# EAGLE design AlphaProtoRev3 (EAGLE 6.5.0)
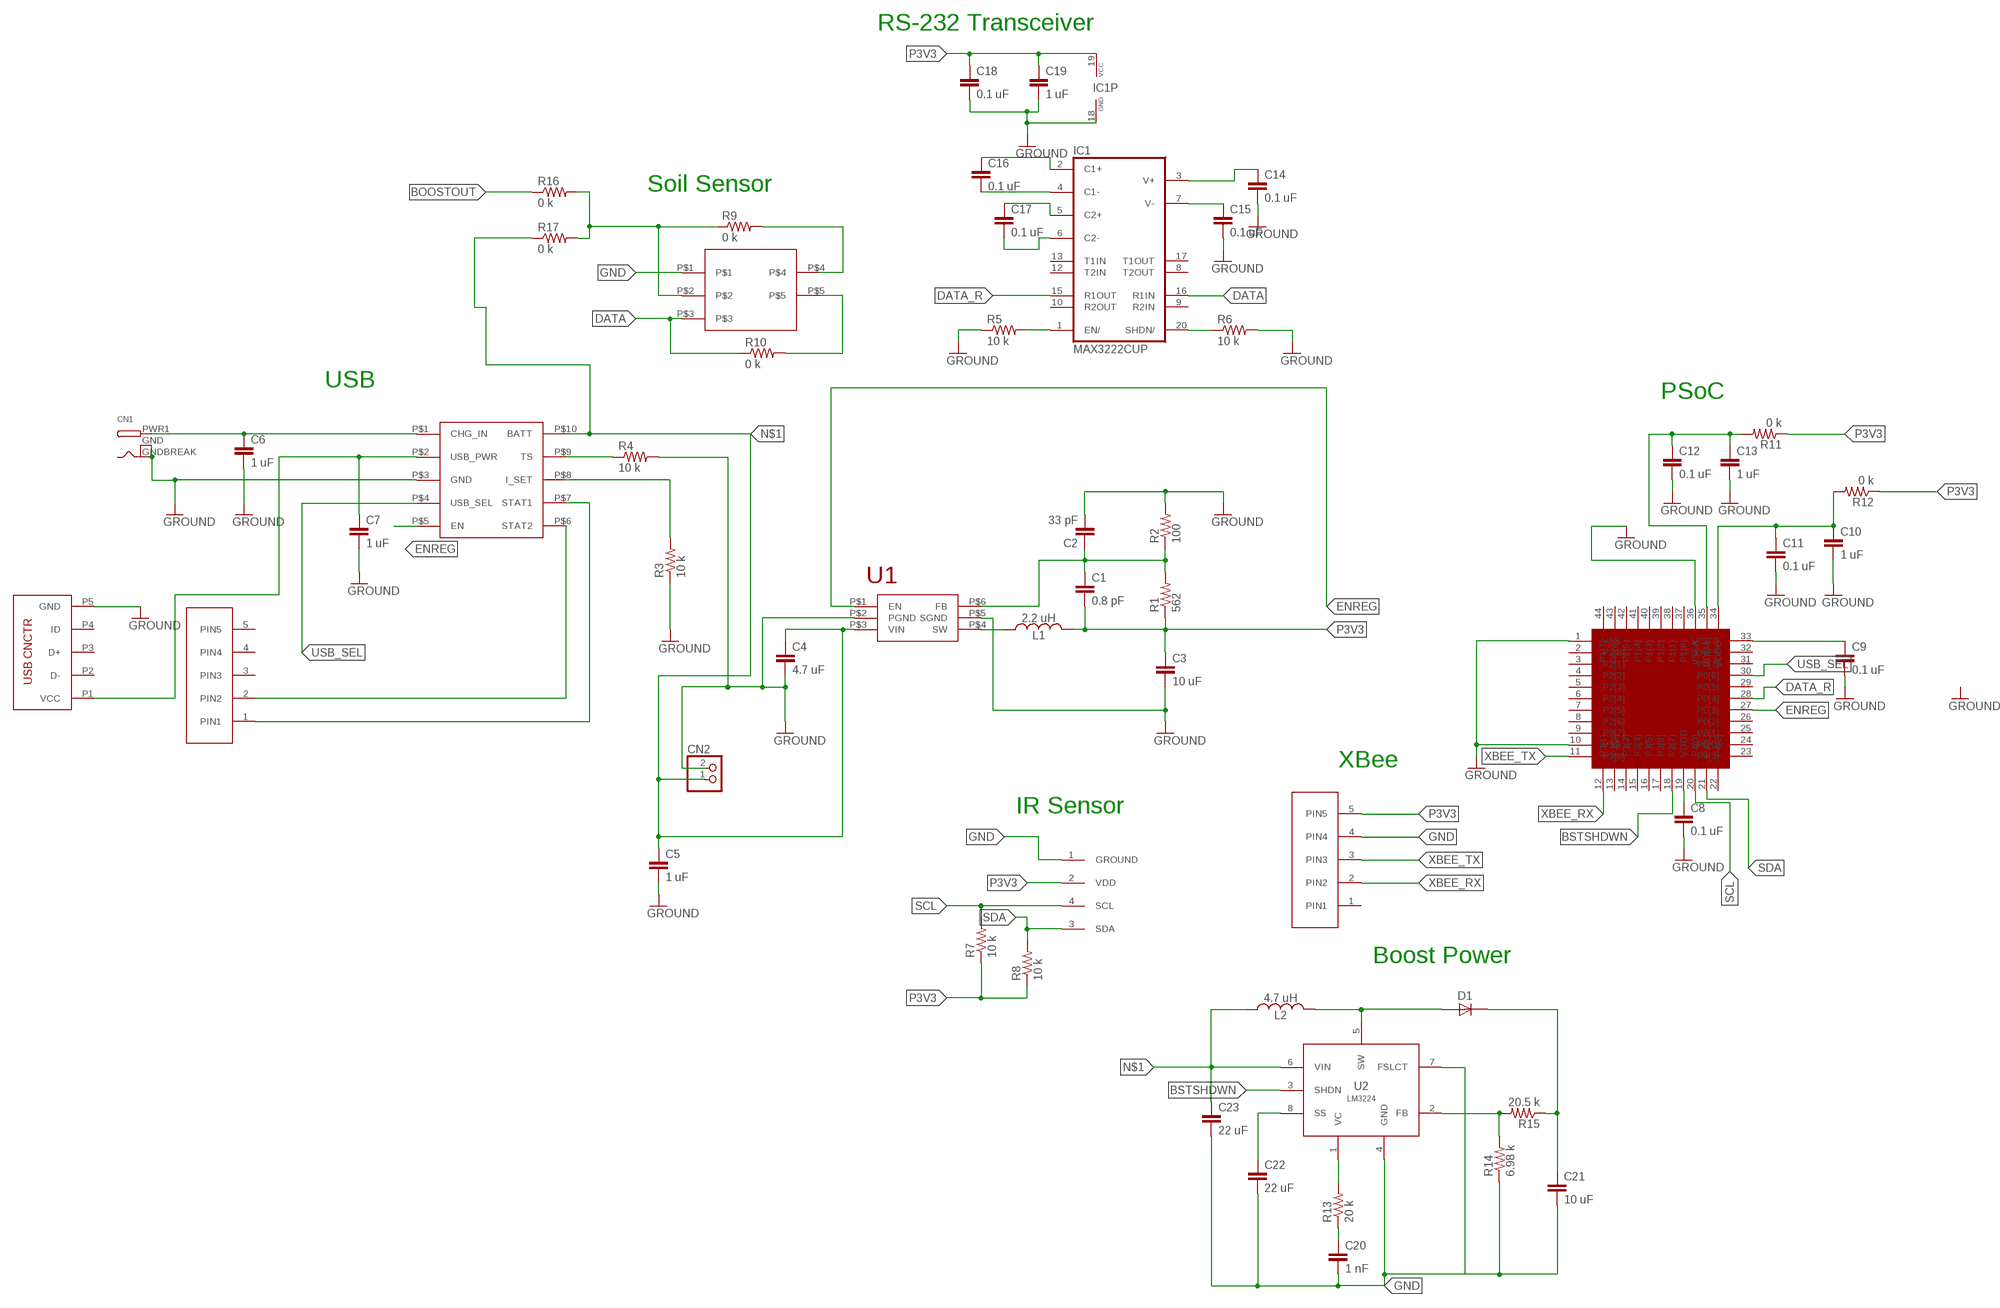
[diagram p0: schematic, sheet 1]

## Parts
C1  0.8 pF  CAPACITOR0603  [0603]
C2  33 pF  CAPACITOR0603  [0603]
C3  10 uF  CAPACITOR0603  [0603]
C4  4.7 uF  CAPACITOR0603  [0603]
C5  1 uF  CAPACITOR0603  [0603]
C6  1 uF  CAPACITOR0603  [0603]
C7  1 uF  CAPACITOR0603  [0603]
C8  0.1 uF  CAPACITOR0603  [0603]
C9  0.1 uF  CAPACITOR0603  [0603]
C10  1 uF  CAPACITOR0603  [0603]
C11  0.1 uF  CAPACITOR0603  [0603]
C12  0.1 uF  CAPACITOR0603  [0603]
C13  1 uF  CAPACITOR0603  [0603]
C14  0.1 uF  CAPACITOR0603  [0603]
C15  0.1 uF  CAPACITOR0603  [0603]
C16  0.1 uF  CAPACITOR0603  [0603]
C17  0.1 uF  CAPACITOR0603  [0603]
C18  0.1 uF  CAPACITOR0603  [0603]
C19  1 uF  CAPACITOR0603  [0603]
C20  1 nF  CAPACITOR0603  [0603]
C21  10 uF  CAPACITOR0603  [0603]
C22  22 uF  CAPACITOR0603  [0603]
C23  22 uF  CAPACITOR0603  [0603]
CN1  DCBARRELSMT  [DCJACK_2MM_SMT]
CN2  JST_2PIN-SMT-RA  [JST-PH-2-SMT-RA]
D1  DIODE  [0603-LED]
IC  PSOC4FP  [TQFP44]
IC1  MAX3222CUP  [TSSOP20]
IRSENSOR  TO39  [TO39]
L1  2.2 uH  INDUCTOR0603  [0603]
L2  4.7 uH  INDUCTOR0603  [0603]
R1  562  RESISTOR0603  [0603]
R2  100  RESISTOR0603  [0603]
R3  10 k  RESISTOR0603  [0603]
R4  10 k  RESISTOR0603  [0603]
R5  10 k  RESISTOR0603  [0603]
R6  10 k  RESISTOR0603  [0603]
R7  10 k  RESISTOR0603  [0603]
R8  10 k  RESISTOR0603  [0603]
R9  0 k  RESISTOR0603  [0603]
R10  0 k  RESISTOR0603  [0603]
R11  0 k  RESISTOR0603  [0603]
R12  0 k  RESISTOR0603  [0603]
R13  20 k  RESISTOR0603  [0603]
R14  6.98 k  RESISTOR0603  [0603]
R15  20.5 k  RESISTOR0603  [0603]
R16  0 k  RESISTOR0603  [0603]
R17  0 k  RESISTOR0603  [0603]
U1  LM3671-407564  [LM3671-407564]
U2  LM3224  [MSOP-8]
U$2  AUDIOJACK  [AUDIOJACK]
U$4  LM3658  [LM3658]
U$7  FCI10118192-0001LF  [FCI10118192-0001LF]
USB  HEADER-5  [NON-5]
XBEE  HEADER-5  [NON-5]

## Nets
BOOSTOUT: C21.1 D1.C R15.1 R16.1
BSTSHDWN: IC.18(P3[7]) U2.3(SHDN)
DATA: IC1.16(R1IN) R10.1 U$2.P$3
DATA_R: IC1.15(R1OUT) IC.28(P0[4])
ENREG: IC.27(P0[3]) U1.P$1(EN) U$4.P$5(EN)
GND: C2.2 C3.2 C4.2 C5.2 C6.2 C7.2 C8.2 C9.2 C10.2 C11.2 C12.2 C13.2 C14.2 C15.2 C18.2 C19.2 C20.2 C21.2 C22.2 C23.2 CN1.GND(GNDBREAK) CN1.GNDBREAK(GND) CN2.2 IC1.18(GND) IC.1(VSS) IC.10(VSS) IC.36(VSSA) IRSENSOR.1(GROUND) R2.2 R3.1 R4.2 R5.1 R6.2 R14.1 U1.P$2(PGND) U1.P$5(SGND) U2.4(GND) U2.7(FSLCT) U$2.P$1 U$4.P$3(GND) U$7.P5(GND) XBEE.4(PIN4) ; supply symbol labelled GROUND
N$1: C4.1 C5.1 C23.1 CN2.1 L2.1 R17.1 U1.P$3(VIN) U2.6(VIN) U$4.P$10(BATT)
N$2: R3.2 U$4.P$8(I_SET)
N$3: L1.1 U1.P$4(SW)
N$4: IC1.1(EN/) R5.2
N$5: C6.1 CN1.PWR1(PWR) U$4.P$1(CHG_IN)
N$6: C1.1 C2.1 R1.2 R2.1 U1.P$6(FB)
N$7: C7.1 U$4.P$2(USB_PWR) U$7.P1(VCC)
N$8: R4.1 U$4.P$9(TS)
N$9: R13.2 U2.1(VC)
N$10: C12.1 C13.1 IC.35(VDDA) R11.2
N$11: U$4.P$6(STAT2) USB.2(PIN2)
N$12: U$4.P$7(STAT1) USB.1(PIN1)
N$13: C17.2 IC1.6(C2-)
N$14: C8.1 IC.19(VDDD)
N$15: C9.1 IC.33(VCCD)
N$16: C17.1 IC1.5(C2+)
N$17: R9.2 U$2.P$4
N$18: R10.2 U$2.P$5
N$19: C16.2 IC1.4(C1-)
N$20: C16.1 IC1.2(C1+)
N$21: C14.1 IC1.3(V+)
N$22: C15.1 IC1.7(V-)
N$23: IC1.20(SHDN/) R6.1
N$24: C10.1 C11.1 IC.34(VDDD) R12.2
N$25: C20.1 R13.1
N$26: D1.A L2.2 U2.5(SW)
N$27: R9.1 R16.2 R17.2 U$2.P$2
N$29: R14.2 R15.2 U2.2(FB)
N$32: C22.1 U2.8(SS)
P3V3: C1.2 C3.1 C18.1 C19.1 IC1.19(VCC) IRSENSOR.2(VDD) L1.2 R1.1 R7.1 R8.1 R11.1 R12.1 XBEE.5(PIN5)
SCL: IC.20(P4[0]) IRSENSOR.4(SCL) R7.2
SDA: IC.21(P4[1]) IRSENSOR.3(SDA) R8.2
USB_SEL: IC.30(P0[6]) U$4.P$4(USB_SEL)
XBEE_RX: IC.12(P3[1]) XBEE.2(PIN2)
XBEE_TX: IC.11(P3[0]) XBEE.3(PIN3)
Unconnected: IC1.8(T2OUT) IC1.9(R2IN) IC1.10(R2OUT) IC1.12(T2IN) IC1.13(T1IN) IC1.17(T1OUT) IC.2(P2[0]) IC.3(P2[1]) IC.4(P2[2]) IC.5(P2[3]) IC.6(P2[4]) IC.7(P2[5]) IC.8(P2[6]) IC.9(P2[7]) IC.13(P3[2]) IC.14(P3[3]) IC.15(P3[4]) IC.16(P3[5]) IC.17(P3[6]) IC.22(P4[2]) IC.23(P4[3]) IC.24(P0[0]) IC.25(P0[1]) IC.26(P0[2]) IC.29(P0[5]) IC.31(P0[7]) IC.32(XRES) IC.37(P1[0]) IC.38(P1[1]) IC.39(P1[2]) IC.40(P1[3]) IC.41(P1[4]) IC.42(P1[5]) IC.43(P1[6]) IC.44(P1[7]) U$7.P2(D-) U$7.P3(D+) U$7.P4(ID) USB.3(PIN3) USB.4(PIN4) USB.5(PIN5) XBEE.1(PIN1)

## Notes on the sheet
- RS-232 Transceiver
- Soil Sensor
- USB
- PSoC
- XBee
- IR Sensor
- Boost Power

## Library data of the parts
C1-C23 = LAB1_BREAKOUT:CAPACITOR: Generic Capacitor
CN1 = adafruit:DCBARREL: 2.0mm DC Barrel Jack DCJACK_2MM_PTH - Through Hole Jack (4UConnector: 05537)
CN2 = adafruit:JST_2PIN: JST 2-Pin Connectors of various flavors SMT-RA (S2B-PH-SM4) 4UConnector #17311 SMT (B2B-PH-SM4) THM-RA (S2B-PH) THM (B2B-PH)
D1 = Alpha (3):DIODE
IC = cypPSoC4:PSOC4FP
IC1 = maxim-5:MAX3222: RS232 TRANSCEIVER
IRSENSOR = mlx:TO39
L1 L2 = LAB1_BREAKOUT:INDUCTOR: Generic Inductor
R1-R17 = LAB1_BREAKOUT:RESISTOR: Generic Resistor
U1 = 136PWR:LM3671-407564: DC DC voltage regulator
U2 = Alpha (3):LM3224
U$2 = AudioJack:AUDIOJACK
U$4 = LM3658:LM3658
U$7 = USB_Connectors_5P_Micro_USB:FCI10118192-0001LF
USB XBEE = LAB1_BREAKOUT:HEADER-5: General 5 Pin 1 Row 2.54mm Spacing Connector

## Board
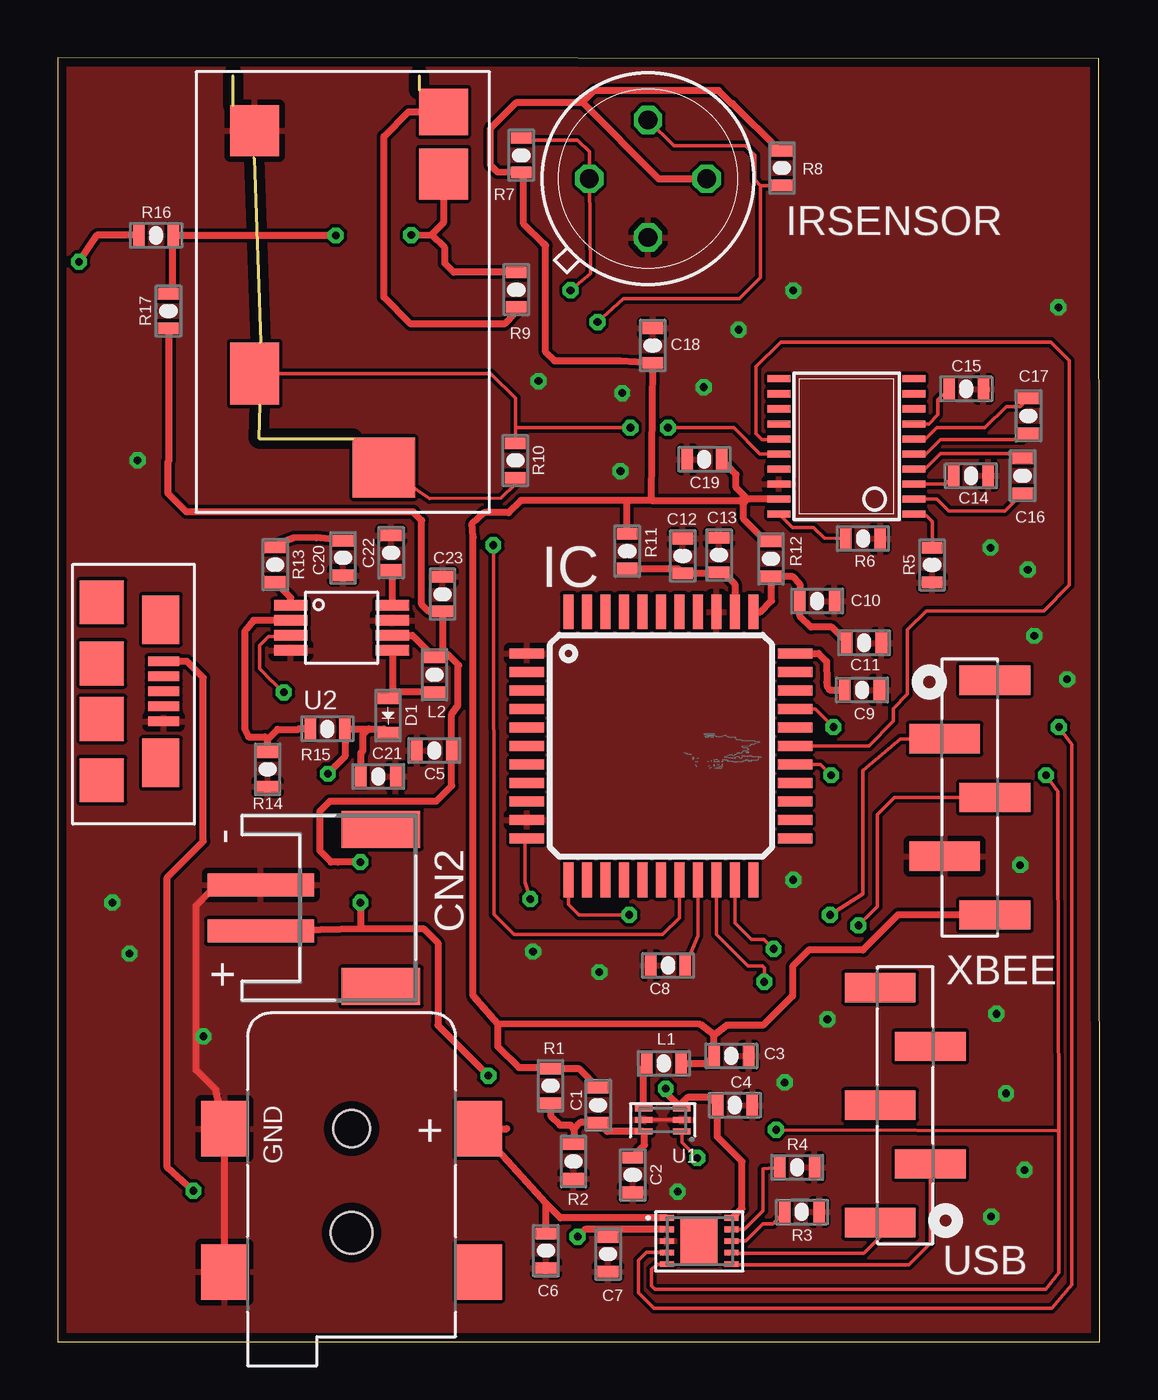
[diagram p1: board, top side]
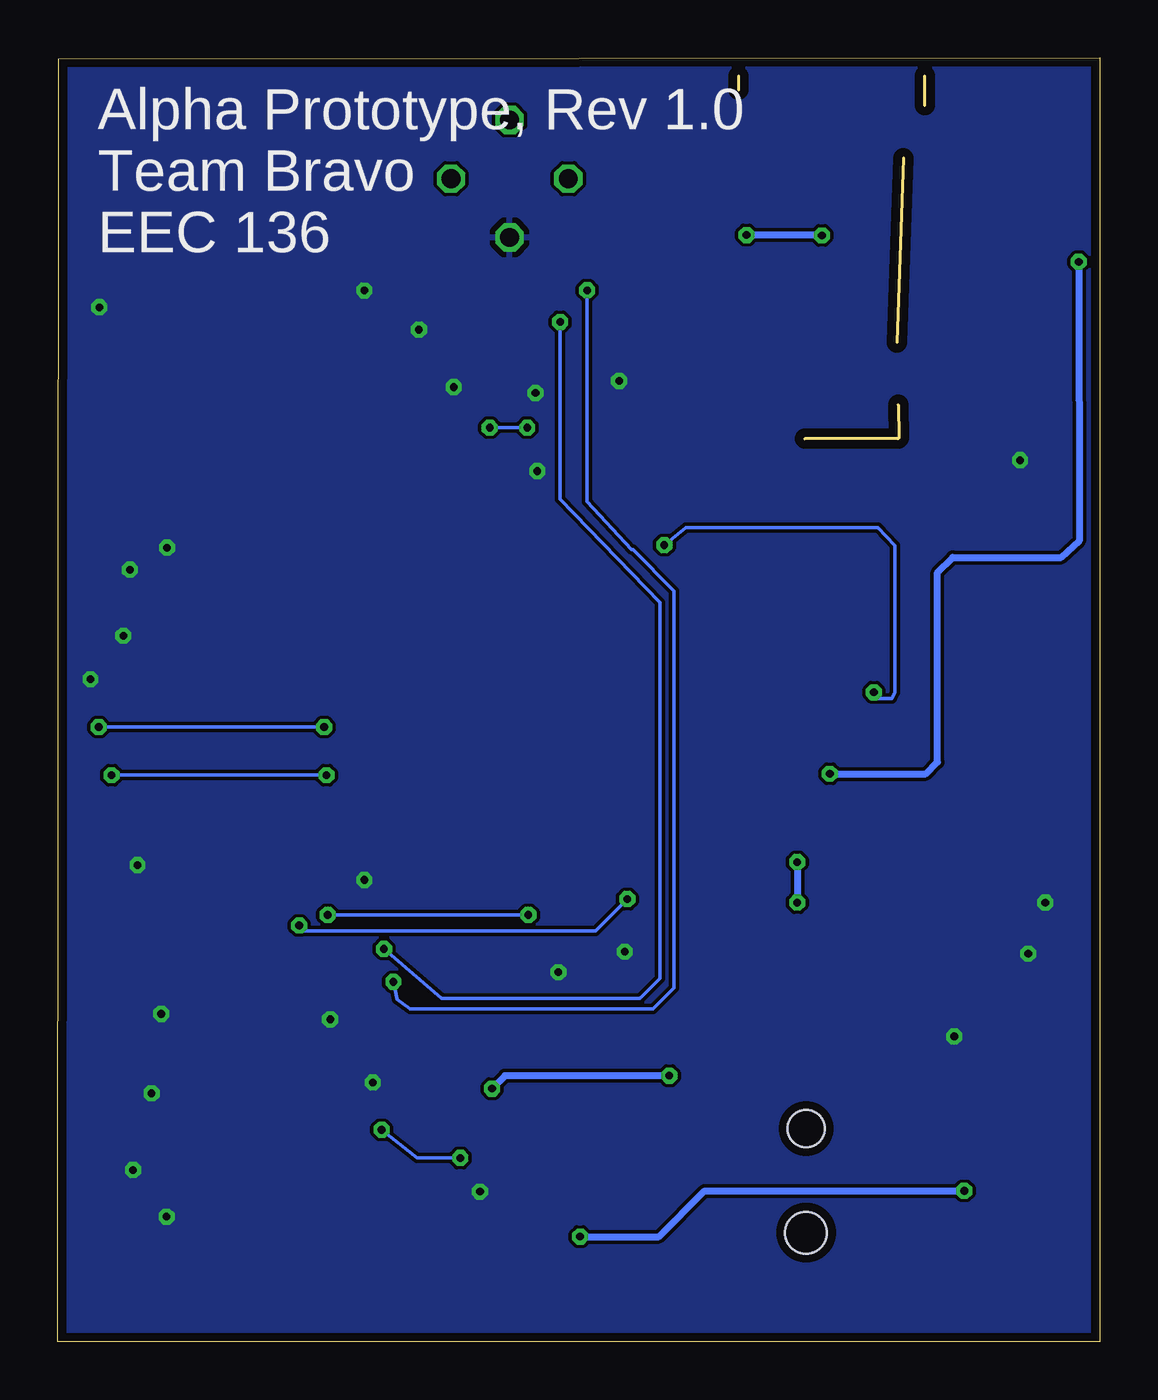
[diagram p2: board, bottom side, seen from below]

Size 45.09 x 55.55 mm. Coordinates in mm from the lower left corner, seen from the top.
Outline: 0,0 45.09,0 45.04,55.5 0,55.55 0,0
Copper layers (1*16): Top 0.0356mm / dielectric 1.5011mm / Bottom 0.0356mm
Design rules "LaenPCBOrder": minimum track width 6mil, minimum drill 13mil, track to track 6mil, track to pad 6mil, pad to pad 6mil, via to via 6mil, smd to smd 6mil, copper to edge 15mil, drill to drill 6mil, minimum pad ring 7mil, minimum via ring 7mil, stop-mask expansion 3mil, vias tented up to drill 0mil, thermal gap 10mil

### Footprints (pad centres in the part's own frame; a part is rotated, then mirrored left to right if it is on the bottom)
0603 = smd 0.5 x 0.9: 1 -0.75,0; 2 0.75,0
DCJACK_2MM_SMT = smd 2.4 x 2: GND 0,-5.5; GNDBREAK 6.2,-5.5; PWR1 0,5.5; PWR2 6.2,5.5 | hole 1.6: 0,0 | hole 1.8: 4.5,0
JST-PH-2-SMT-RA = smd 1 x 4.6: 1 1,-3.7; 2 -1,-3.7 | smd 1.6 x 3.4: NC1 -3.4,1.5; NC2 3.4,1.5
0603-LED = smd 0.5 x 0.9: A -0.75,0; C 0.75,0
TQFP44 = smd 1.5 x 0.44: 1 -5.8,4; 2 -5.8,3.2; 3 -5.8,2.4; 4 -5.8,1.6; 5 -5.8,0.8; 6 -5.8,0; 7 -5.8,-0.8; 8 -5.8,-1.6; 9 -5.8,-2.4; 10 -5.8,-3.2; 11 -5.8,-4; 23 5.8,-4; 24 5.8,-3.2; 25 5.8,-2.4; 26 5.8,-1.6; 27 5.8,-0.8; 28 5.8,0; 29 5.8,0.8; 30 5.8,1.6; 31 5.8,2.4; 32 5.8,3.2; 33 5.8,4 | smd 0.44 x 1.5: 12 -4,-5.8; 13 -3.2,-5.8; 14 -2.4,-5.8; 15 -1.6,-5.8; 16 -0.8,-5.8; 17 0,-5.8; 18 0.8,-5.8; 19 1.6,-5.8; 20 2.4,-5.8; 21 3.2,-5.8; 22 4,-5.8; 34 4,5.8; 35 3.2,5.8; 36 2.4,5.8; 37 1.6,5.8; 38 0.8,5.8; 39 0,5.8; 40 -0.8,5.8; 41 -1.6,5.8; 42 -2.4,5.8; 43 -3.2,5.8; 44 -4,5.8
TSSOP20 = smd 0.305 x 0.991: 1 -2.925,-2.918; 2 -2.275,-2.918; 3 -1.625,-2.918; 4 -0.975,-2.918; 5 -0.325,-2.918; 6 0.325,-2.918; 7 0.975,-2.918; 8 1.625,-2.918; 9 2.275,-2.918; 10 2.925,-2.918; 11 2.925,2.918; 12 2.275,2.918; 13 1.625,2.918; 14 0.975,2.918; 15 0.325,2.918; 16 -0.325,2.918; 17 -0.975,2.918; 18 -1.625,2.918; 19 -2.275,2.918; 20 -2.925,2.918
TO39 = drill 0.813 octagon: 1 0,-2.54; 2 2.54,0; 3 0,2.54; 4 -2.54,0
LM3671-407564 = smd 0.75 x 0.25: P$1 -0.825,0.5; P$2 -0.825,0; P$3 -0.825,-0.5; P$4 0.825,-0.5; P$5 0.825,0; P$6 0.825,0.5
MSOP-8 = smd 1.45 x 0.45: 1 -2.2,0.975; 2 -2.2,0.325; 3 -2.2,-0.325; 4 -2.2,-0.975; 5 2.2,-0.975; 6 2.2,-0.325; 7 2.2,0.325; 8 2.2,0.975
AUDIOJACK = smd 2.21 x 2.108: P$1 1.27,-2.54; P$2 3.15,5.626 | smd 2.692 x 2.108: P$3 11.786,-2.54 | smd 2.007 x 2.108: P$4 0.457,5.626 | smd 2.591 x 2.692: P$5 15.85,3.048
LM3658 = smd 0.6 x 0.25: P$1 0,0; P$2 0,-0.5; P$3 0,-1; P$4 0,-1.5; P$5 0,-2; P$6 2.8,-2; P$7 2.8,-1.5; P$8 2.8,-1; P$9 2.8,-0.5; P$10 2.8,0 | smd 1.6 x 2: P$11 1.4,-1
FCI10118192-0001LF = smd 0.4 x 1.35: P1 -1.3,2.675; P2 -0.65,2.675; P3 0,2.675; P4 0.65,2.675; P5 1.3,2.675 | smd 1.9 x 1.9: P$1 -1.2,0; P$2 1.2,0; P$3 3.85,0; P$4 -3.85,0 | smd 2.1 x 1.6: P$5 -3.1,2.55; P$6 3.1,2.55
NON-5 = smd 1.27 x 3.061: 1 -5.08,1.086; 2 -2.54,-1.086; 3 0,1.086; 4 2.54,-1.086; 5 5.08,1.086

### Placement (x,y rotation side)
C1  23.38,10.24 90 top
C2  24.88,7.21 270 top
C3  29.15,12.37 0 top
C4  29.3,10.24 0 top
C5  16.29,25.58 180 top
C6  21.12,3.94 270 top
C7  23.81,3.78 270 top
C8  26.4,16.28 180 top
C9  34.8,28.19 0 top
C10  32.85,32.04 0 top
C11  34.89,30.24 0 top
C12  27.04,34 90 top
C13  28.61,34.04 90 top
C14  39.51,37.47 0 top
C15  39.31,41.22 0 top
C16  41.74,37.47 90 top
C17  42,40.06 90 top
C18  25.74,43.1 90 top
C19  27.98,38.18 180 top
C20  12.34,33.91 270 top
C21  13.87,24.46 0 top
C22  14.43,34.14 90 top
C23  16.65,32.35 90 top
CN1  12.71,9.22 270 top
CN2  12.48,18.77 270 top
D1  14.29,27.09 270 top
IC  26.1,25.78 0 top
IC1  34.12,38.73 90 top
IRSENSOR  25.54,50.32 0 top
L1  26.23,12.04 0 top
L2  16.31,28.85 270 top
R1  21.32,11.07 270 top
R2  22.31,7.8 270 top
R3  32.19,5.61 180 top
R4  31.99,7.54 0 top
R5  37.83,33.6 90 top
R6  34.84,34.75 0 top
R7  20.05,51.33 90 top
R8  31.33,50.77 270 top
R9  19.84,45.52 270 top
R10  19.8,38.13 270 top
R11  24.64,34.2 270 top
R12  30.86,33.87 270 top
R13  9.41,33.62 270 top
R14  9.08,24.77 90 top
R15  11.67,26.52 180 top
R16  4.25,47.87 0 top
R17  4.79,44.59 90 top
U1  26.17,9.6 180 top
U2  12.28,30.89 0 top
U$2  11.06,53.67 270 top
U$4  26.35,5.36 0 top
U$7  1.91,28.14 270 top
USB  36.66,10.24 90 top
XBEE  39.46,23.55 270 top

### Tracks (layer width: path | path; a pad name or v marks a point on that pad's centre or on a via)
BOOSTOUT  (via drill 0.33)
  Top 0.305: 13.45,26.52 R15.1 12.42,25.32 11.99,24.89 11.99,24.88 v11.68,24.57 | 13.45,26.52 14.11,26.52 D1.C | 13.45,26.52 13.21,26.28 13.21,25.57 13.12,25.48 C21.1 | R16.1 1.69,47.87 v0.91,46.72
  Bottom 0.305: v11.68,24.57 7.53,24.57 7.02,25.08 7.02,33.27 6.36,33.93 1.68,33.93 0.9,34.65 v0.91,46.72
BSTSHDWN  (via drill 0.33)
  Top 0.152: IC.18 26.9,18.34 26.18,17.61 19.74,17.61 18.87,18.48 v18.85,34.47 | v9.78,28.09 9.3,28.57 9.28,28.57 8.74,29.12 8.74,30.12 9.13,30.52 10.04,30.52 U2.3
  Bottom 0.152: v18.85,34.47 17.91,35.23 9.6,35.23 8.88,34.44 8.88,28.08 9,27.84 9.58,27.84 9.78,28.04 v9.78,28.09
DATA  (via drill 0.33)
  Top 0.152: R10.1 19.8,39.55 | 19.8,39.55 19.8,40.82 18.73,41.88 U$2.P$3 | IC1.16 30.39,38.41 29.25,39.55 v26.4,39.55 | v24.78,39.55 19.8,39.55
  Bottom 0.152: v26.4,39.55 v24.78,39.55
DATA_R
  Top 0.152: IC.28 35.09,25.78 36.16,26.85 36.16,27.41 36.77,28.02 36.77,30.81 37.58,31.62 42.66,31.62 43.78,32.74 43.78,42.44 42.96,43.26 31.28,43.26 30.21,42.19 30.21,39.29 30.47,39.04 31.19,39.04 IC1.15
ENREG  (via drill 0.33)
  Top 0.152: IC.27 32.99,24.98 v33.47,24.51 | v42.76,24.51 43.27,23.8 43.27,22.43 43.3,9.17 | U$4.P$5 25.93,3.36 25.69,3.12 25.69,2.41 25.84,2.26 42.76,2.26 43.32,2.97 43.3,9.17 | U1.P$1 27,8.62 v27.67,7.95 | v31.08,9.17 43.25,9.12 43.3,9.17
  Bottom 0.152: v33.47,24.51 v42.76,24.51 | v27.67,7.95 29.55,7.95 v31.08,9.17
GND  (via drill 0.33)
  Top 0.152: U1.P$2 U1.P$5
  Top 0.305: CN1.GNDBREAK CN1.GND 6.83,10.91 5.98,11.76 5.98,18.87 6.87,19.76 10.04,19.76 CN2.2
  other vias: 31.46,11.21 26.82,6.49 33.3,13.94 41.03,10.74 40.61,14.19 41.83,7.43 40.39,5.41 31.83,19.98 20.56,16.88 23.43,15.99 42.25,30.54 43.68,28.66 41.64,20.62 40.36,34.35 41.97,33.4 29.46,43.79 27.95,41.3 31.83,45.48 43.29,44.75 24.42,41.05 20.8,41.57 24.35,37.67 3.45,38.14 2.36,19 3.1,16.79 6.3,13.21
  pour Top: -1.03,49.72 -1.03,-1.27 46.38,-1.03 46.32,56.65 -1.08,56.53
  pour Bottom: -2.35,49.14 -2.27,-2.34 47.79,-2.15 47.71,57.67 11.82,57.66 -2.31,57.81
N$1  (via drill 0.33)
  Top 0.305: CN2.1 13.09,17.87 | 13.09,17.87 15.82,17.87 16.45,17.25 16.45,13.69 v18.63,11.51 | v13.09,19 13.09,17.87 | U$4.P$10 29.2,5.36 29.6,5.77 29.6,7.8 28.54,8.87 28.54,10.22 C4.1 28.19,10.59 27.27,10.59 27,10.32 U1.P$3 26.3,10.8 v26.3,10.95 | v13.09,20.75 12.13,20.75 11.82,20.75 11.34,21.23 11.34,22.96 11.77,23.39 16.38,23.39 17.04,24.05 C5.1 17.04,27.14 17.31,27.53 17.31,29.21 17.36,29.26 16.9,29.72 16.42,29.72 L2.1 | L2.1 16.65,29.95 C23.1 16.05,31.6 15.75,31.9 15.75,35.53 15.38,35.9 5.58,35.9 4.78,36.7 4.78,38.08 4.79,38.09 R17.1 | U2.6 15.35,30.56 L2.1
  Bottom 0.305: v13.09,20.75 v13.09,19 | v18.63,11.51 25.74,11.51 v26.3,10.95
N$2
  Top 0.152: U$4.P$8 29.77,4.36 30.52,5.11 30.94,5.11 R3.2
N$3
  Top 0.305: U1.P$4 25.35,11.91 L1.1
N$4
  Top 0.152: R5.2 37.83,35.48 37.58,35.74 37.12,35.74 IC1.1
N$5
  Top 0.305: 19.43,9.22 CN1.PWR1 21.12,5.98 | C6.1 21.12,5.98 | U$4.P$1 21.74,5.36 21.12,5.98
N$6
  Top 0.305: C2.1 24.88,8 25.39,8.51 25.39,9.06 U1.P$6 23.77,9.1 C1.1 22.61,9.49 22.34,9.22 | 22.34,9.22 22.34,8.57 R2.1 | R1.2 21.32,9.78 21.73,9.37 22.19,9.37 22.34,9.22
N$7  (via drill 0.33)
  Top 0.305: U$4.P$2 24.14,4.86 | 24.14,4.86 C7.1 | 24.14,4.86 22.8,4.86 v22.49,4.55 | v5.87,6.53 4.74,7.54 4.74,20.09 6.3,21.65 6.3,28.73 5.59,29.44 U$7.P1
  Bottom 0.305: v22.49,4.55 19.09,4.55 17.11,6.53 v5.87,6.53
N$8
  Top 0.152: U$4.P$9 29.71,4.86 30.52,5.66 30.52,7.48 R4.1
N$9
  Top 0.305: U2.1 10.08,32.2 R13.2
N$10
  Top 0.305: R11.2 26.84,33.45 C12.1 28.57,33.25 C13.1 28.8,33.29 29.3,32.79 IC.35 | IC.35
N$11
  Top 0.152: USB.2 37.75,4.26 36.82,3.33 29.18,3.33 U$4.P$6
N$12
  Top 0.152: USB.1 35.58,4.53 34.89,3.83 29.18,3.83 U$4.P$7
N$13
  Top 0.152: IC1.6 37.55,39.06 38.04,39.55 40.12,39.55 41.03,40.46 41.66,40.46 C17.2
N$14
  Top 0.152: IC.19 27.7,17.57 C8.1
N$15
  Top 0.305: IC.33 32.92,29.78 33.26,29.44 33.27,28.54 33.29,28.37 33.39,28.21 C9.1
N$16
  Top 0.152: IC1.5 37.56,38.41 38.19,39.04 41.73,39.04 C17.1
N$17
  Top 0.305: U$2.P$4 15.18,53.21 14.11,52.15 14.11,45.19 15.27,44.03 19.33,44.03 19.84,44.54 R9.2
N$18
  Top 0.152: R10.2 19.8,37.11 19.19,36.5 16.08,36.49 U$2.P$5
N$19
  Top 0.152: IC1.4 37.52,37.76 38.19,38.43 41.53,38.43 C16.2
N$20
  Top 0.152: IC1.2 38.03,36.46 38.54,35.94 40.97,35.94 C16.1
N$21
  Top 0.152: IC1.3 38.41,37.11 C14.1
N$22
  Top 0.152: IC1.7 37.69,39.71 38.09,40.11 38.09,40.76 C15.1
N$23
  Top 0.152: R6.1 33.17,34.76 32.7,35.23 31.79,35.23 IC1.20
N$24
  Top 0.305: IC.34 30.4,31.58 30.89,32.07 30.89,33.1 R12.2 31.78,33.12 32.11,32.79 C10.1 32.12,32.03 32.12,31.38 32.59,30.91 33.5,30.91 34.14,30.28 C11.1
N$25
  Top 0.305: C20.1 11.19,34.78 10.21,34.77 9.57,34.53 R13.1
N$26
  Top 0.305: U2.5 14.48,28.03 D1.A 14.55,28.1 L2.2
N$27  (via drill 0.33)
  Top 0.305: U$2.P$2 16.69,48.41 16.18,47.9 | v12.03,47.87 R16.2 4.94,47.8 4.94,45.49 R17.2 | v15.29,47.88 16.18,47.9 | R9.1 17.13,46.27 16.75,46.65 16.75,47.33 16.18,47.9
  Bottom 0.305: v12.03,47.87 v15.29,47.88
N$29
  Top 0.305: R15.2 10.43,26.52 10.4,26.49 9.51,26.49 9.08,26.06 | R14.2 9.08,26.06 | U2.2 8.47,31.21 8.09,30.73 8.09,26.49 8.26,26.18 8.97,26.18 9.08,26.06
N$32
  Top 0.305: U2.8 14.48,33.33 C22.1
P3V3
  Top 0.305: IC1.19 29.85,36.46 | 29.85,36.46 29.35,36.96 29.35,37.53 C19.1 | 22.7,53.62 19.85,53.62 18.73,52.5 18.73,50.9 19.02,50.61 R7.1 20.16,50.48 20.16,48.36 20.99,47.52 21.02,47.52 21.11,47.43 21.11,42.82 21.49,42.44 24.33,42.44 C18.1 25.69,36.4 | 22.7,53.62 26,50.32 IRSENSOR.2 | R8.1 31.24,51.52 29.2,53.57 29.15,53.57 28.59,54.13 23.2,54.13 22.7,53.62 | 29.64,36.26 29.85,36.46 | L1.2 28.07,12.04 C3.1 28.4,13.27 | 28.4,13.27 27.8,13.73 19.04,13.74 | 19.04,13.74 17.97,14.96 17.97,34.81 17.93,35.41 18.44,35.87 19.51,35.87 20.04,36.4 24.7,36.4 | 28.4,13.27 28.93,13.68 28.94,13.69 30.52,13.69 31.79,14.96 31.79,16.23 32.5,16.94 34.84,16.94 36.36,18.47 XBEE.5 | 19.04,13.74 19.04,12.78 19.95,11.86 21.29,11.86 R1.1 22.54,11.82 C1.2 | 25.69,36.4 29.5,36.4 29.64,36.26 | 25.69,36.4 24.7,36.4 | R11.1 24.64,36.34 24.7,36.4 | R12.1 30.64,34.62 29.67,35.6 29.67,36.23 29.64,36.26
SCL  (via drill 0.33)
  Top 0.152: R7.2 20.14,51.99 22.49,51.99 23,51.49 IRSENSOR.4 23.05,46.2 v22.19,45.49 | IC.20 28.5,17.61 29.86,16.26 30.49,16.26 30.58,16.17 30.58,15.58 v30.57,15.57
  Bottom 0.152: v22.19,45.49 22.19,36.35 20.26,34.27 20.21,34.27 18.43,32.49 18.43,15.32 19.34,14.4 29.86,14.4 30.42,14.81 v30.57,15.57
SDA  (via drill 0.33)
  Top 0.152: R8.2 30.4,50.02 | 30.4,50.02 30.16,50.27 30.16,51.33 29.76,51.74 26.66,51.74 IRSENSOR.3 | 30.4,50.02 30.4,46.04 29.5,45.14 24.47,45.14 v23.36,44.12 | IC.21 29.3,18.12 30.01,17.41 30.56,17.41 v30.98,16.99
  Bottom 0.152: v23.36,44.12 23.36,36.45 19.04,31.98 19.04,15.72 19.9,14.86 28.49,14.86 v30.98,16.99
USB_SEL  (via drill 0.33)
  Top 0.152: IC.30 32.78,27.38 v33.57,26.59 | v43.32,26.59 43.88,25.83 43.88,2.46 43.02,1.45 25.79,1.45 25.13,2.11 25.13,3.53 25.46,3.86 U$4.P$4
  Bottom 0.152: v33.57,26.59 v43.32,26.59
XBEE_RX  (via drill 0.33)
  Top 0.152: XBEE.2 36.46,26.09 34.84,24.71 34.84,19.38 v33.41,18.47 | v24.73,18.47 22.54,18.47 22.1,18.91 IC.12
  Bottom 0.152: v33.41,18.47 v24.73,18.47
XBEE_TX  (via drill 0.33)
  Top 0.152: XBEE.3 36.2,23.55 35.47,22.82 35.47,18.83 v34.65,18.01 | v20.45,19.15 20.22,19.88 20.22,21.7 IC.11
  Bottom 0.152: v20.45,19.15 21.83,17.77 34.4,17.77 v34.65,18.01

### Text on the board
bNames: Alpha Prototype, Rev 1.0 / Team Bravo / EEC 136